# Altium schematic sheet MergeRev4_0.SchDoc
size A
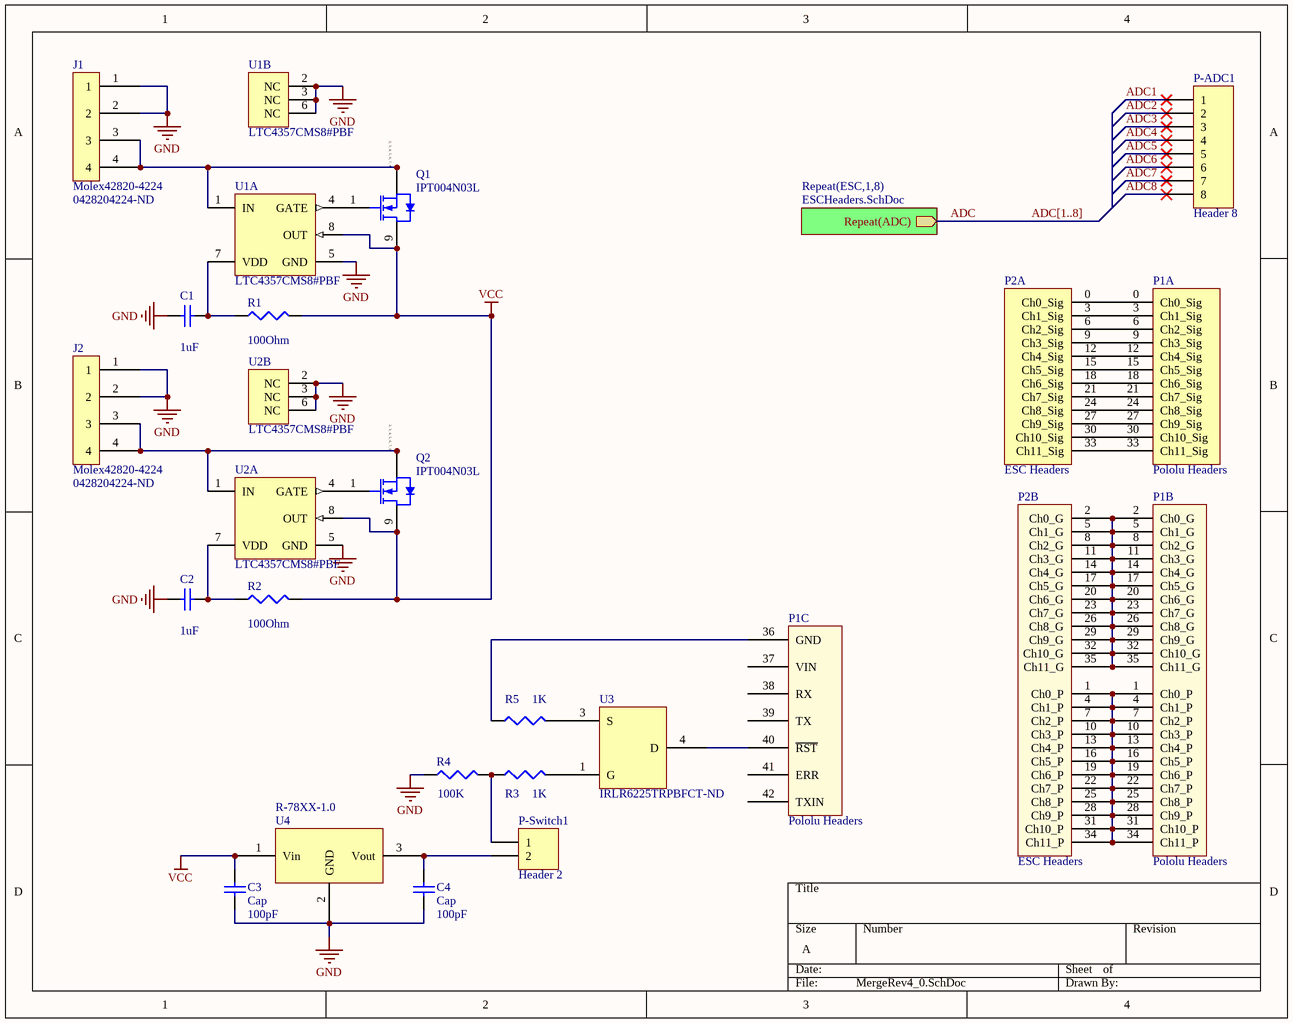
[diagram p0: MergeRev4_0.SchDoc]

## Parts
C1  value 1uF  [C1206]  (hidden comment: Cap Semi)
C2  value 1uF  [C1206]  (hidden comment: Cap Semi)
C3  Cap  value 100pF  [1608[0603]]
C4  Cap  value 100pF  [1608[0603]]
J1  Molex42820-4224  Supplier Part Number 1: 0428204224-ND  [Molex42820-4224]
J2  Molex42820-4224  Supplier Part Number 1: 0428204224-ND  [Molex42820-4224]
P1  Pololu Headers  [Pololu Headers]  (parts A,B,C of 3)
P2  ESC Headers  [Pololu Headers]  (parts A,B of 3)
P-ADC1  Header 8  [HDR1X8]
P-Switch1  Header 2  [HDR1X2]
Q1  IPT004N03L  [INF-PG-HSOF-8-1_V]
Q2  IPT004N03L  [INF-PG-HSOF-8-1_V]
R1  value 100Ohm  [J1-0603]  (hidden comment: Res3)
R2  value 100Ohm  [J1-0603]  (hidden comment: Res3)
R3  value 1K  [J1-0603]  (hidden comment: Res3)
R4  value 100K  [J1-0603]  (hidden comment: Res3)
R5  value 1K  [J1-0603]  (hidden comment: Res3)
U1  LTC4357CMS8#PBF  [LT-MS8-8_N]  (parts A,B of 2)
U2  LTC4357CMS8#PBF  [LT-MS8-8_N]  (parts A,B of 2)
U3  IRLR6225TRPBFCT-ND  [IRLR6225_DT]
U4  R-78XX-1.0  [R-785.0-1.0]

## Sub-sheets
Repeat(ESC,1,8) = ESCHeaders.SchDoc: Repeat(ADC) (out)

## Nets
GND: C1.1 C2.1 C3.1 C4.1 J1.1 J1.2 J2.1 J2.2 R4.1 U1.2(NC) U1.3(NC) U1.5(GND) U1.6(NC) U2.2(NC) U2.3(NC) U2.5(GND) U2.6(NC) U4.2(GND)
VCC: C3.2 Q1.9(D) Q2.9(D) R1.2 R2.2 U1.8(OUT) U2.8(OUT) U4.1(Vin)
ADC: sheet Repeat(ESC,1,8)/Repeat(ADC)
ADC1: P-ADC1.1
ADC2: P-ADC1.2
ADC3: P-ADC1.3
ADC4: P-ADC1.4
ADC5: P-ADC1.5
ADC6: P-ADC1.6
ADC7: P-ADC1.7
ADC8: P-ADC1.8
NetC1_2: C1.2 R1.1 U1.7(VDD)
NetC2_2: C2.2 R2.1 U2.7(VDD)
NetC4_2: C4.2 P-Switch1.2 U4.3(Vout)
NetJ1_3: J1.3 J1.4 Q1.2(S) Q1.3(S) Q1.4(S) Q1.5(S) Q1.6(S) Q1.7(S) Q1.8(S) U1.1(IN)
NetJ2_3: J2.3 J2.4 Q2.2(S) Q2.3(S) Q2.4(S) Q2.5(S) Q2.6(S) Q2.7(S) Q2.8(S) U2.1(IN)
NetP1_0: P1.0(Ch0_Sig) P2.0(Ch0_Sig)
NetP1_1: P1.1(Ch0_P) P1.4(Ch1_P) P1.7(Ch2_P) P1.10(Ch3_P) P1.13(Ch4_P) P1.16(Ch5_P) P1.19(Ch6_P) P1.22(Ch7_P) P1.25(Ch8_P) P1.28(Ch9_P) P1.31(Ch10_P) P1.34(Ch11_P) P2.1(Ch0_P) P2.4(Ch1_P) P2.7(Ch2_P) P2.10(Ch3_P) P2.13(Ch4_P) P2.16(Ch5_P) P2.19(Ch6_P) P2.22(Ch7_P) P2.25(Ch8_P) P2.28(Ch9_P) P2.31(Ch10_P) P2.34(Ch11_P)
NetP1_2: P1.2(Ch0_G) P1.5(Ch1_G) P1.8(Ch2_G) P1.11(Ch3_G) P1.14(Ch4_G) P1.17(Ch5_G) P1.20(Ch6_G) P1.23(Ch7_G) P1.26(Ch8_G) P1.29(Ch9_G) P1.32(Ch10_G) P1.35(Ch11_G) P2.2(Ch0_G) P2.5(Ch1_G) P2.8(Ch2_G) P2.11(Ch3_G) P2.14(Ch4_G) P2.17(Ch5_G) P2.20(Ch6_G) P2.23(Ch7_G) P2.26(Ch8_G) P2.29(Ch9_G) P2.32(Ch10_G) P2.35(Ch11_G)
NetP1_3: P1.3(Ch1_Sig) P2.3(Ch1_Sig)
NetP1_6: P1.6(Ch2_Sig) P2.6(Ch2_Sig)
NetP1_9: P1.9(Ch3_Sig) P2.9(Ch3_Sig)
NetP1_12: P1.12(Ch4_Sig) P2.12(Ch4_Sig)
NetP1_15: P1.15(Ch5_Sig) P2.15(Ch5_Sig)
NetP1_18: P1.18(Ch6_Sig) P2.18(Ch6_Sig)
NetP1_21: P1.21(Ch7_Sig) P2.21(Ch7_Sig)
NetP1_24: P1.24(Ch8_Sig) P2.24(Ch8_Sig)
NetP1_27: P1.27(Ch9_Sig) P2.27(Ch9_Sig)
NetP1_30: P1.30(Ch10_Sig) P2.30(Ch10_Sig)
NetP1_33: P1.33(Ch11_Sig) P2.33(Ch11_Sig)
NetP1_36: P1.36(GND) R5.1
NetP1_40: P1.40(~{RST}) U3.4(D)
NetP-Switch1_1: P-Switch1.1 R3.1 R4.2
NetQ1_1: Q1.1(GATE) U1.4(GATE)
NetQ2_1: Q2.1(GATE) U2.4(GATE)
NetR3_2: R3.2 U3.1(G)
NetR5_2: R5.2 U3.3(S)

Not connected (* = marked no-connect by the designer): P1 37(VIN) 38(RX) 39(TX) 41(ERR) 42(TXIN)

## Buses and harness runs
bus ADC[1..8]

## Notes on the sheet
- (in symbol IPT004N03L) 2, 3, 4, 5, 6, 7, 8

## Library data of the parts
C1 C2 = Cap Semi: Capacitor (Semiconductor SIM Model); Published: 8-Jun-2000; LatestRevisionDate: 29-May-2009; LatestRevisionNote: IPC-7351 Footprint Added.; PackageReference: C1206; Publisher: Altium Limited; PackageDescription: Chip Capacitor
C3 C4 = Cap: Capacitor; Published: 8-Jun-2000; LatestRevisionDate: 17-Jul-2002; LatestRevisionNote: Re-released for DXP Platform.; PackageReference: RAD-0.3; Publisher: Altium Limited; PackageDescription: Radial Cap, Thru-Hole; 2 Leads; 0.3 in Pin Spacing
P2 = Pololu Headers
P-ADC1 = Header 8: Header, 8-Pin; LatestRevisionDate: 17-Jul-2002; LatestRevisionNote: Re-released for DXP Platform.; Publisher: Altium Limited
P-Switch1 = Header 2: Header, 2-Pin; LatestRevisionDate: 17-Jul-2002; LatestRevisionNote: Re-released for DXP Platform.; Publisher: Altium Limited
Q1 Q2 = IPT004N03L: N-Channel OptiMOS(TM) Power-MOSFET, 30 V VDS, 300 A ID, -55 to 175 degC, PG-HSOF-8, Reel, Green; Manufacturer: Infineon; Green: TRUE; ID (max): 300 A; IDpuls (max): 1,200 A; Polarity: FALSE; Ptot (max): 300 W; QG: 122 nC; RDS (on) (max): 0.4 mOhm; RthJA (max): 40 K/W; RthJC (max): 0.5 K/W; VDS (max): 30 V; VGS(th) (max): 2.2 V; VGS(th) (min): 0.7 V; DatasheetVersion: Rev. 1.2; PackageVersion: Rev. 04; PackageReference: PG-HSOF-8-1; PackageDescription: 8-Pin Plastic (Green) Heatlink Small Outline Flat Leads Package, 10.375 x 9.9 mm Body, 0.8 mm Pitch; Supplier 1: Mouser; Supplier Part Number 1: N/A; Halogen-free: TRUE; Packing: Reel; Technology: OptiMOS(TM); Mounting Technology: Surface Mount; PartNumber: IPT004N03L; ComponentLink1Description: Manufacturer URL; ComponentLink1URL: http://www.infineon.com/; ComponentLink2Description: Datasheet; ComponentLink2URL: http://www.infineon.com/dgdl/IPT004N03L_rev1.2.pdf?folderId=db3a304313b8b5a60113cee8763b02d7&fileId=db3a30433e9d5d11013e9e0f382600c2; ComponentLink3Description: Package Specification; ComponentLink3URL: http://www.infineon.com/cms/packages/SMD_-_Surface_Mounted_Devices/P-PG-HSOF/P-PG-HSOF-08-1.html?__locale=en
R1-R5 = Res3: Resistor; Published: 8-Jun-2000; LatestRevisionDate: 29-May-2009; LatestRevisionNote: IPC-7351 Footprint Added.; PackageReference: J1-0603; Publisher: Altium Limited; PackageDescription: Chip Resistor
U1 U2 = LTC4357CMS8#PBF: Positive High Voltage Ideal Diode Controller, 9 to 80 V Vin, 8-pin SOP (MS8-8), 0 to 70 degC, Pb-Free; Manufacturer: Linear Technology; Ideal Diode: Single, External, N-Channel; DatasheetVersion: Rev. D; PackageVersion: Rev. G, 03/2012; PackageReference: MS8-8; PackageDescription: 8-Pin Plastic MSOP, Body 3 x 3 mm, Pitch 0.65 mm; Supplier 1: Digi-Key; Supplier Part Number 1: LTC4357CMS8#PBF-ND; Supplier 2: Farnell; Supplier Part Number 2: 1432779; Supplier 3: Newark; Supplier Part Number 3: 56M9468; RoHS: TRUE; Mounting Technology: Surface Mount; PartNumber: LTC4357CMS8#PBF; ComponentLink1Description: Manufacturer URL; ComponentLink1URL: http://www.linear.com/; ComponentLink2Description: Datasheet; ComponentLink2URL: http://cds.linear.com/docs/en/datasheet/4357fd.pdf; ComponentLink3Description: Package Specification; ComponentLink3URL: http://cds.linear.com/docs/en/packaging/05081660_G_MS8.pdf
J1 J2 = Molex42820-4224: Supplier 1: Digi-Key; ComponentLink1Description: DataSheet; ComponentLink1URL: https://www.molex.com/pdm_docs/sd/428204224_sd.pdf
U3 = IRLR6225TRPBFCT-ND: mnfr_part_num: IRLR6225TRPBFCT-ND